# EAGLE board BBQ (EAGLE 6.5.0)
CHECK_DATE: 11.03.14; CHECK_NAME: Mart Liik; COMPANY: TRINAMIC; DRAW_DATE: 11.03.14; DRAW_NAME: Ahto Moorast; PROJECT: TMC Breakout board panel 1; REV: 01B
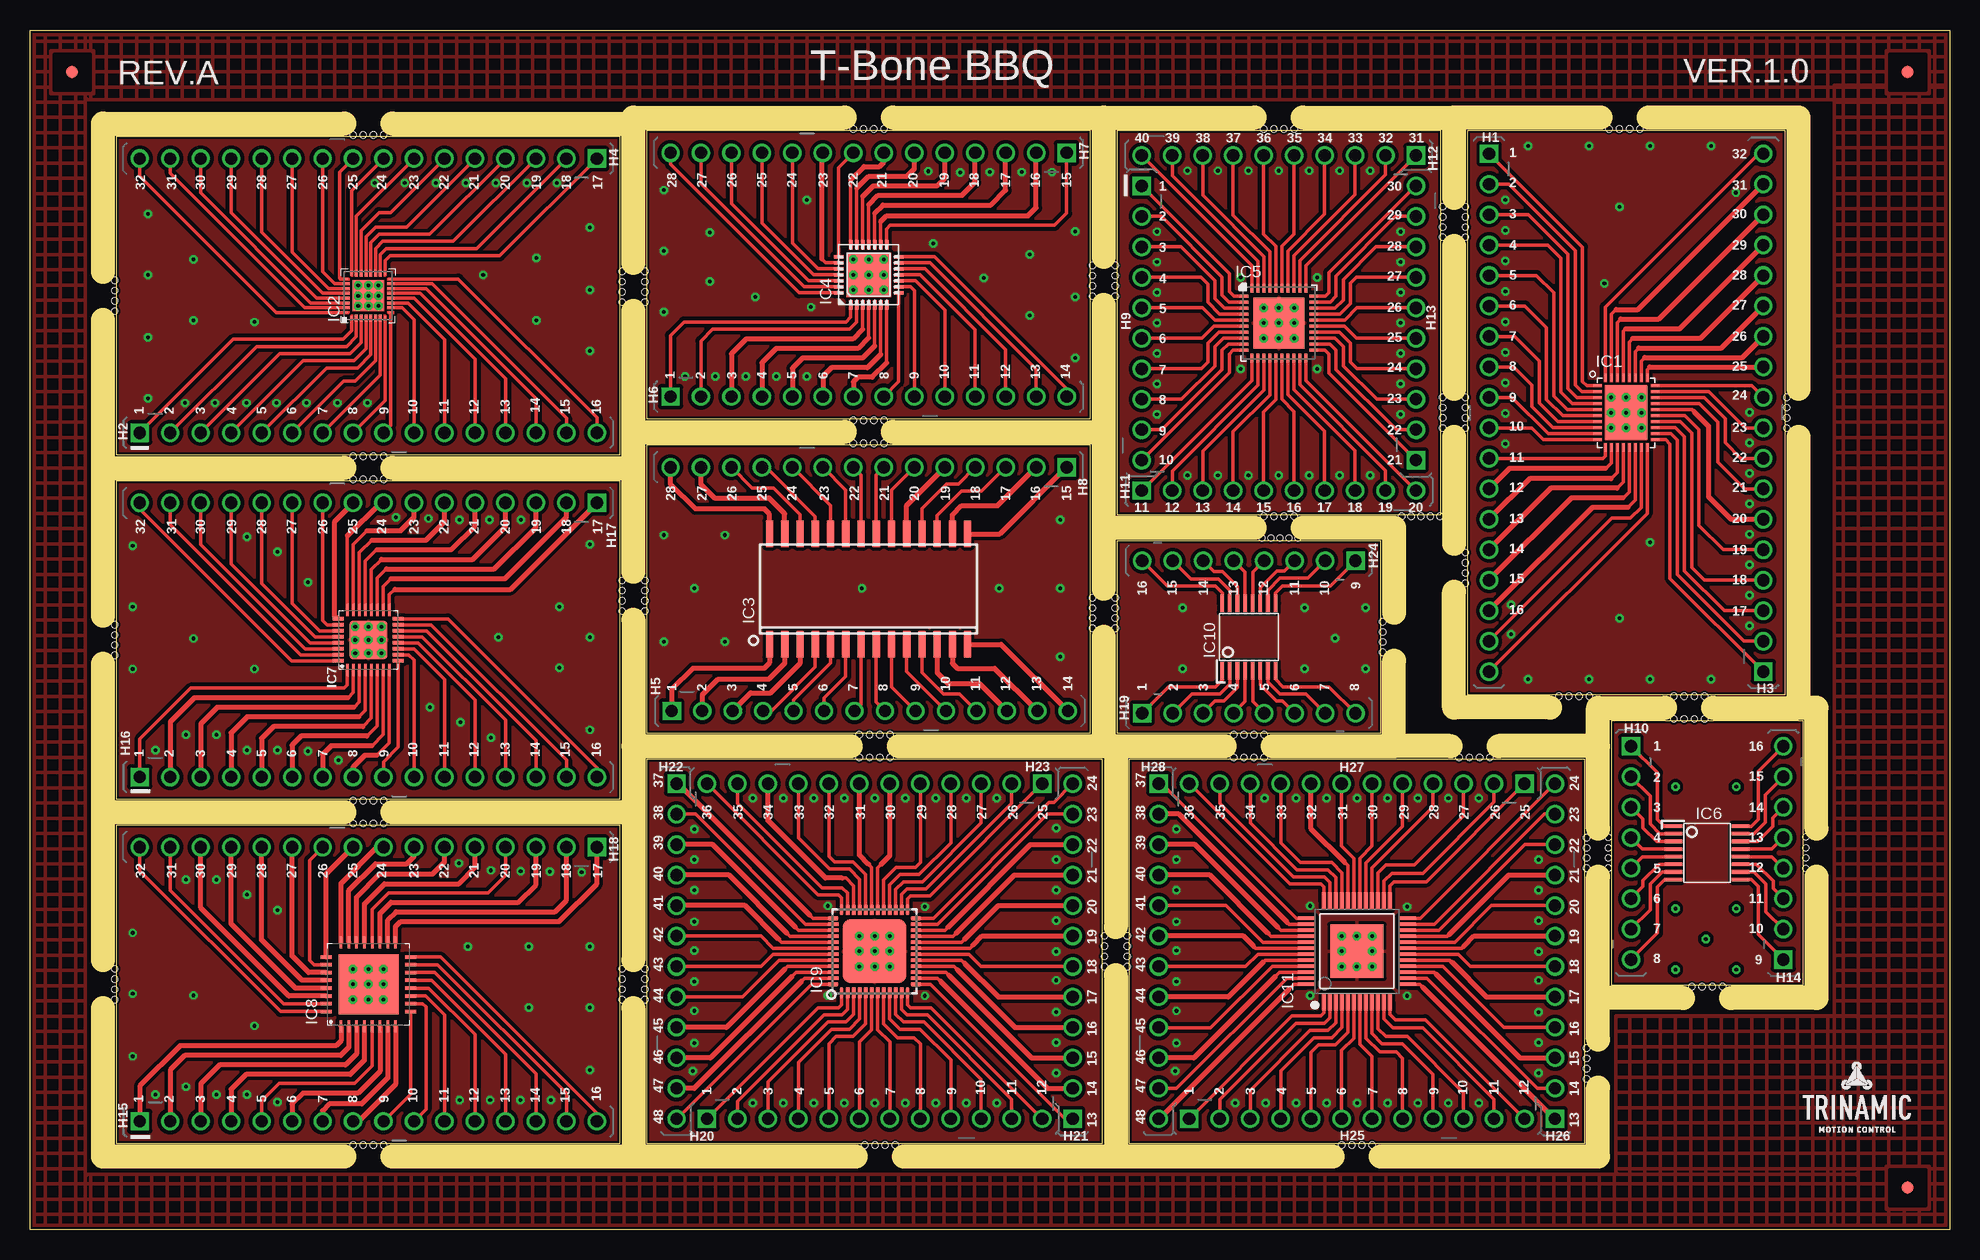
[diagram p3: board, top side]
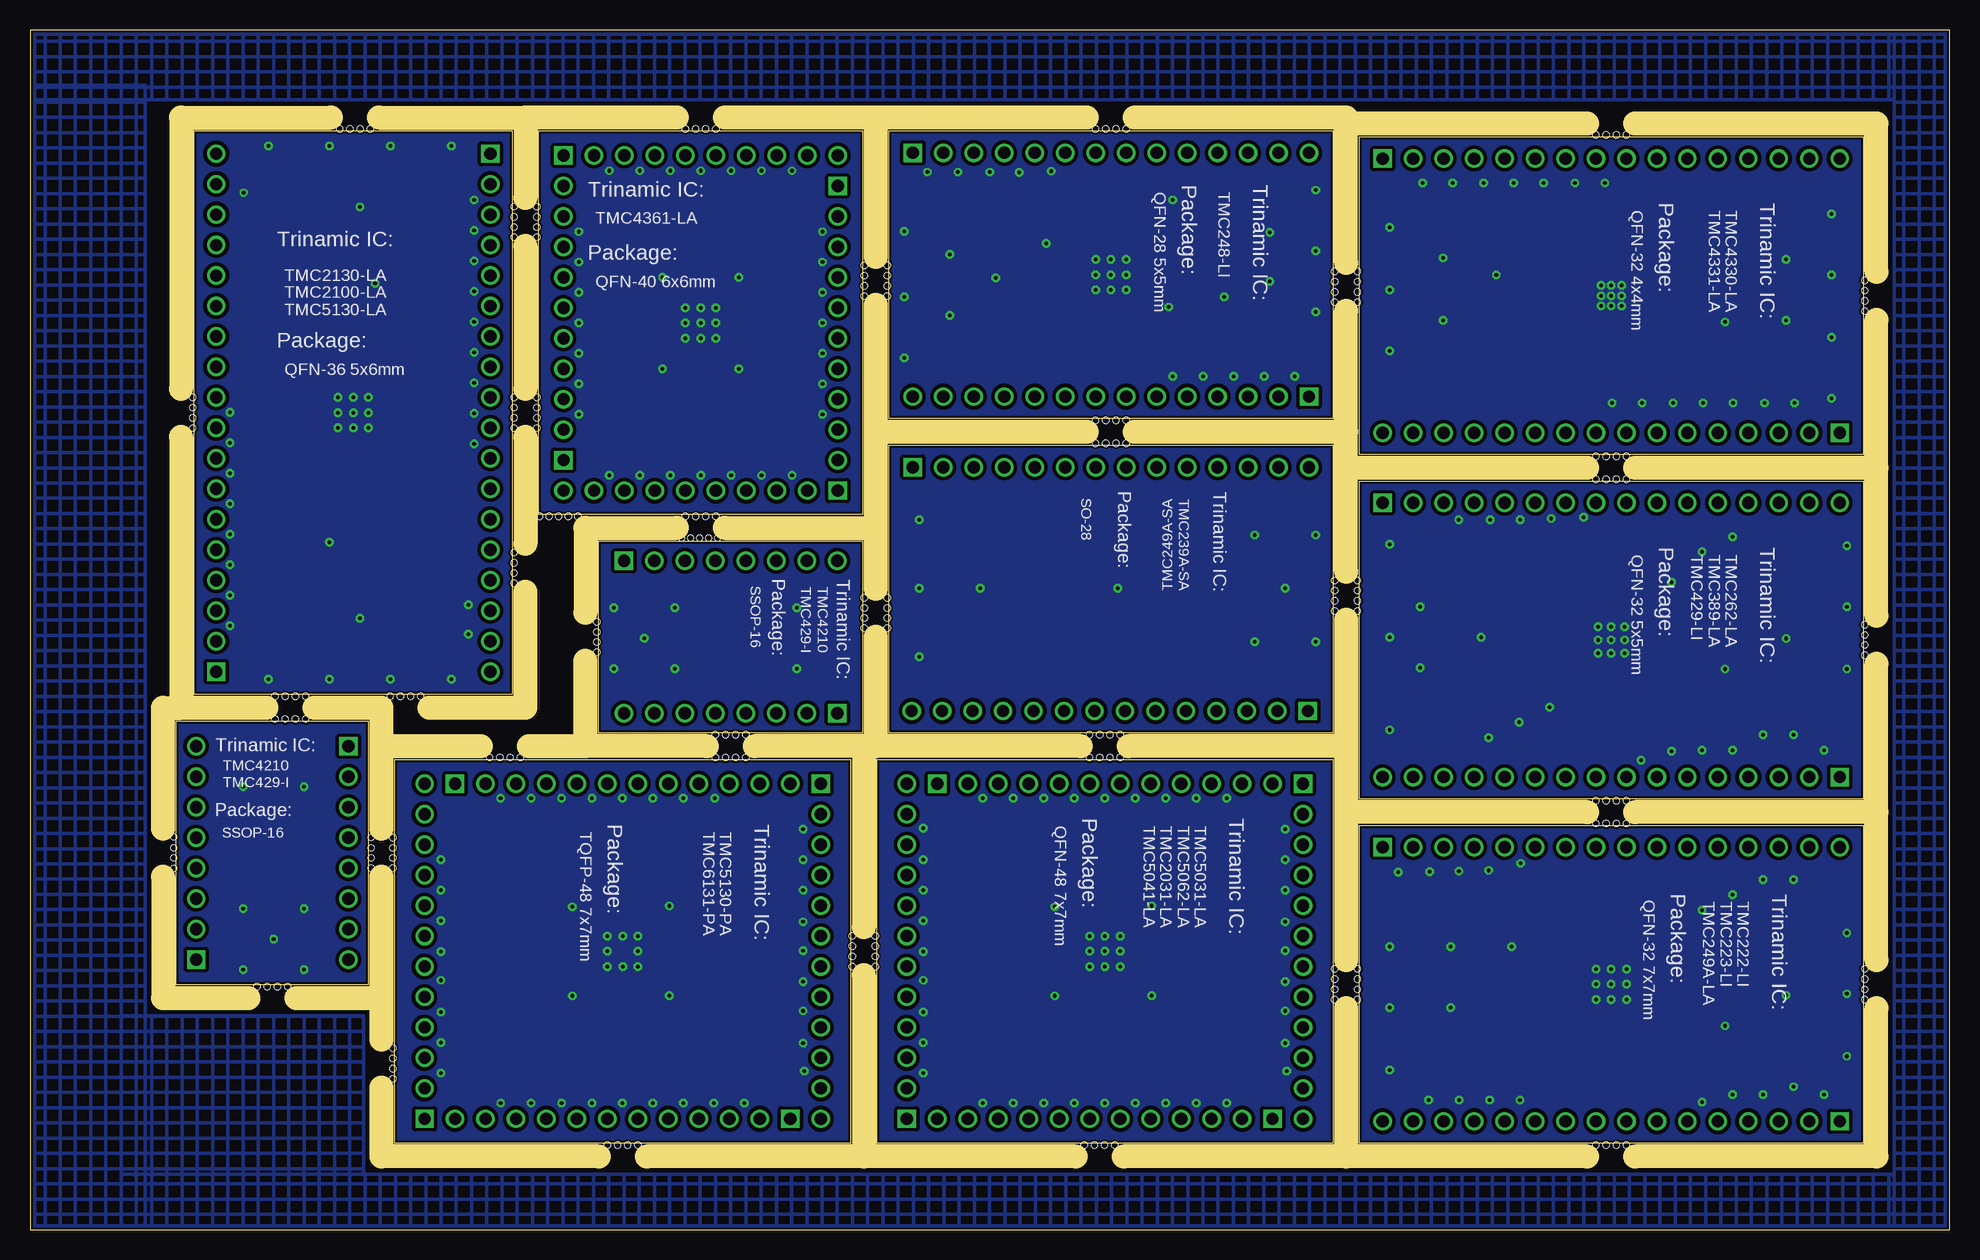
[diagram p4: board, bottom side, seen from below]

Size 160 x 100 mm. Coordinates in mm from the lower left corner, seen from the top.
Outline: 131.8,20.4 147.8,20.4 147.8,42.4 131.8,42.4 131.8,20.4
Outline: 88.4,41.4 88.4,65.4 51.4,65.4 51.4,41.4 88.4,41.4
Outline: 49.2,35.9 49.2,62.4 7.2,62.4 7.2,35.9 49.2,35.9
Outline: 49.2,7.2 49.2,33.7 7.2,33.7 7.2,7.2 49.2,7.2
Outline: 49.2,64.6 49.2,91.1 7.2,91.1 7.2,64.6 49.2,64.6
Outline: 88.4,67.6 88.4,91.6 51.4,91.6 51.4,67.6 88.4,67.6
Outline: 89.4,7.2 89.4,39.2 51.4,39.2 51.4,7.2 89.4,7.2
Outline: 90.6,59.6 117.6,59.6 117.6,91.6 90.6,91.6 90.6,59.6
Outline: 119.8,44.6 146.3,44.6 146.3,91.6 119.8,91.6 119.8,44.6
Outline: 129.6,7.2 129.6,39.2 91.6,39.2 91.6,7.2 129.6,7.2
Outline: 112.6,41.4 112.6,57.4 90.6,57.4 90.6,41.4 112.6,41.4
Outline: 0,0 0,100 160,100 160,0 0,0
Copper layers (1*16): Top 0.035mm / dielectric 1.5mm / Bottom 0.035mm
Design rules "Brandner_Artec *": minimum track width 0.3mm, minimum drill 0.3mm, track to track 0.3mm, track to pad 0.35mm, pad to pad 0.4mm, via to via 0.3mm, smd to smd 0.3mm, copper to edge 0.2mm, drill to drill 0.15mm, minimum pad ring 10mil, minimum via ring 0.2mm, stop-mask expansion 0.1mm, vias tented up to drill 0.3mm, thermal gap 10mil
Net classes: 0 default: width 0.3 mm, drill 0.3 mm, clearance 0.3 mm; 1 wider: width 0.4 mm, drill 0.3 mm, clearance 0.4 mm
Holes 0.5 mm at 26.93,35.75 7.05,79.12 7.05,78.27 7.05,77.42 7.05,76.57 26.93,91.25 27.78,91.25 28.63,91.25 29.48,91.25 51.25,21.72 49.35,21.72 51.25,20.87 51.25,20.02 51.25,19.17 49.35,20.87 49.35,20.02 49.35,19.17 7.05,50.42 7.05,49.57 7.05,48.72 7.05,47.87 7.05,21.72 7.05,20.87 7.05,20.02 7.05,19.17 27.78,35.75 28.63,35.75 29.48,35.75 26.93,33.85 27.78,33.85 28.63,33.85 29.48,33.85 26.93,64.45 27.78,64.45 28.63,64.45 29.48,64.45 26.93,62.55 27.78,62.55 28.63,62.55 29.48,62.55 26.93,7.05 27.78,7.05 28.63,7.05 29.48,7.05 69.58,7.05 70.43,7.05 71.28,7.05 72.13,7.05 109.33,7.05 110.18,7.05 111.03,7.05 111.88,7.05 68.63,91.75 69.48,91.75 70.33,91.75 71.18,91.75 102.83,91.75 103.68,91.75 104.53,91.75 105.38,91.75 131.63,91.75 132.48,91.75 133.33,91.75 134.18,91.75 49.35,79.87 49.35,79.02 49.35,78.17 49.35,77.32 51.25,79.87 51.25,79.02 51.25,78.17 51.25,77.32 49.35,54.11 49.35,53.26 49.35,52.41 49.35,51.56 51.25,54.11 51.25,53.26 51.25,52.41 51.25,51.56 68.63,67.45 69.48,67.45 70.33,67.45 71.18,67.45 68.63,65.55 69.48,65.55 70.33,65.55 71.18,65.55 69.13,41.25 69.98,41.25 70.83,41.25 71.68,41.25 69.13,39.35 69.98,39.35 70.83,39.35 71.68,39.35 88.55,80.37 88.55,79.52 88.55,78.67 88.55,77.82 90.45,80.37 90.45,79.52 90.45,78.67 90.45,77.82 88.55,52.67 88.55,51.82 88.55,50.97 88.55,50.12 90.45,52.67 90.45,51.82 90.45,50.97 90.45,50.12 89.55,24.47 89.55,23.62 89.55,22.77 89.55,21.92 91.45,24.47 91.45,23.62 91.45,22.77 91.45,21.92 100.33,41.25 101.18,41.25 102.03,41.25 102.88,41.25 100.33,39.35 101.18,39.35 102.03,39.35 102.88,39.35 112.75,50.67 112.75,49.82 112.75,48.97 112.75,48.12 119.13,39.35 119.98,39.35 120.83,39.35 121.68,39.35 119.65,85.27 119.65,84.42 119.65,83.57 119.65,82.72 119.65,69.37 119.65,68.52 119.65,67.67 119.65,66.82 119.65,56.43 119.65,55.58 119.65,54.73 119.65,53.88 127.43,44.46 128.28,44.46 129.13,44.46 129.98,44.46 137.03,44.46 137.88,44.46 138.73,44.46 139.58,44.46 129.75,15.12 129.75,14.27 129.75,13.42 129.75,12.57 138.53,20.25 139.38,20.25 140.23,20.25 141.08,20.25 148.03,32.72 148.03,31.82 148.03,30.97 148.03,30.09 146.45,69.37 146.45,68.52 146.45,67.67 137.03,42.56 137.88,42.56 138.73,42.56 139.58,42.56 102.83,59.45 103.68,59.45 104.53,59.45 105.38,59.45 102.68,57.65 103.43,57.65 104.18,57.65 104.93,57.65 146.45,66.82 114.33,59.45 115.13,59.45 115.93,59.45 116.73,59.45 117.53,59.45 117.75,85.27 117.75,84.42 117.75,83.57 117.75,82.72 117.75,69.37 117.75,68.52 117.75,67.67 117.75,66.82 105.68,57.65 129.75,32.67 129.75,31.82 129.75,30.97 129.75,30.12 131.57,32.7 131.57,31.82 131.57,30.97 131.57,30.12
Milling: 72 lines

## Footprints (pad centres in the part's own frame; a part is rotated, then mirrored left to right if it is on the bottom)
FIDUCIAL = smd 1 x 1: FID 0,0
18PIN_2.54_TH = drill 1.02 square: 1 -21.59,0 | drill 1.02: 2 -19.05,0; 3 -16.51,0; 4 -13.97,0; 5 -11.43,0; 6 -8.89,0; 7 -6.35,0; 8 -3.81,0; 9 -1.27,0; 10 1.27,0; 11 3.81,0; 12 6.35,0; 13 8.89,0; 14 11.43,0; 15 13.97,0; 16 16.51,0; 17 19.05,0; 18 21.59,0
16PIN_2.54_TH = drill 1.02 square: 1 -19.05,0 | drill 1.02: 2 -16.51,0; 3 -13.97,0; 4 -11.43,0; 5 -8.89,0; 6 -6.35,0; 7 -3.81,0; 8 -1.27,0; 9 1.27,0; 10 3.81,0; 11 6.35,0; 12 8.89,0; 13 11.43,0; 14 13.97,0; 15 16.51,0; 16 19.05,0
14PIN_2.54_TH = drill 1.02 square: 1 -16.51,0 | drill 1.02: 2 -13.97,0; 3 -11.43,0; 4 -8.89,0; 5 -6.35,0; 6 -3.81,0; 7 -1.27,0; 8 1.27,0; 9 3.81,0; 10 6.35,0; 11 8.89,0; 12 11.43,0; 13 13.97,0; 14 16.51,0
10PIN_2.54_TH = drill 1.02 square: 1 -11.43,0 | drill 1.02: 2 -8.89,0; 3 -6.35,0; 4 -3.81,0; 5 -1.27,0; 6 1.27,0; 7 3.81,0; 8 6.35,0; 9 8.89,0; 10 11.43,0
8PIN_2.54_TH = drill 1.02 square: 1 -8.89,0 | drill 1.02: 2 -6.35,0; 3 -3.81,0; 4 -1.27,0; 5 1.27,0; 6 3.81,0; 7 6.35,0; 8 8.89,0
12PIN_2.54_TH = drill 1.02 square: 1 -13.97,0 | drill 1.02: 2 -11.43,0; 3 -8.89,0; 4 -6.35,0; 5 -3.81,0; 6 -1.27,0; 7 1.27,0; 8 3.81,0; 9 6.35,0; 10 8.89,0; 11 11.43,0; 12 13.97,0
QFN36 = smd 0.7 x 0.25: 1 -2.4,2.25; 2 -2.4,1.75; 3 -2.4,1.25; 4 -2.4,0.75; 5 -2.4,0.25; 6 -2.4,-0.25; 7 -2.4,-0.75; 8 -2.4,-1.25; 9 -2.4,-1.75; 10 -2.4,-2.25; 19 2.4,-2.25; 20 2.4,-1.75; 21 2.4,-1.25; 22 2.4,-0.75; 23 2.4,-0.25; 24 2.4,0.25; 25 2.4,0.75; 26 2.4,1.25; 27 2.4,1.75; 28 2.4,2.25 | smd 0.25 x 0.7: 11 -1.75,-2.9; 12 -1.25,-2.9; 13 -0.75,-2.9; 14 -0.25,-2.9; 15 0.25,-2.9; 16 0.75,-2.9; 17 1.25,-2.9; 18 1.75,-2.9; 29 1.75,2.9; 30 1.25,2.9; 31 0.75,2.9; 32 0.25,2.9; 33 -0.25,2.9; 34 -0.75,2.9; 35 -1.25,2.9; 36 -1.75,2.9 | smd 3.6 x 4.6: GND_PAD 0,0
QFN-32_4X4 = smd 2.6 x 2.6: EXP 0,0 | smd 0.29 x 0.125: P1 -1.86,1.4; P8 -1.86,-1.4; P17 1.86,-1.4; P24 1.86,1.4 | smd 0.58 x 0.25: P2 -1.86,1; P3 -1.86,0.6; P4 -1.86,0.2; P5 -1.86,-0.2; P6 -1.86,-0.6; P7 -1.86,-1; P18 1.86,-1; P19 1.86,-0.6; P20 1.86,-0.2; P21 1.86,0.2; P22 1.86,0.6; P23 1.86,1 | smd 0.125 x 0.29: P9 -1.4,-1.86; P16 1.4,-1.86; P25 1.4,1.86; P32 -1.4,1.86 | smd 0.25 x 0.58: P10 -1,-1.86; P11 -0.6,-1.86; P12 -0.2,-1.86; P13 0.2,-1.86; P14 0.6,-1.86; P15 1,-1.86; P26 1,1.86; P27 0.6,1.86; P28 0.2,1.86; P29 -0.2,1.86; P30 -0.6,1.86; P31 -1,1.86
SO28 = smd 2.2 x 0.6: 1 -4.6,8.255; 2 -4.6,6.985; 3 -4.6,5.715; 4 -4.6,4.445; 5 -4.6,3.175; 6 -4.6,1.905; 7 -4.6,0.635; 8 -4.6,-0.635; 9 -4.6,-1.905; 10 -4.6,-3.175; 11 -4.6,-4.445; 12 -4.6,-5.715; 13 -4.6,-6.985; 14 -4.6,-8.255; 15 4.6,-8.255; 16 4.6,-6.985; 17 4.6,-5.715; 18 4.6,-4.445; 19 4.6,-3.175; 20 4.6,-1.905; 21 4.6,-0.635; 22 4.6,0.635; 23 4.6,1.905; 24 4.6,3.175; 25 4.6,4.445; 26 4.6,5.715; 27 4.6,6.985; 28 4.6,8.255
QFN28_5X5 = smd 0.8 x 0.3: 1 -2.5,1.5; 2 -2.5,1; 3 -2.5,0.5; 4 -2.5,0; 5 -2.5,-0.5; 6 -2.5,-1; 7 -2.5,-1.5; 15 2.5,-1.5; 16 2.5,-1; 17 2.5,-0.5; 18 2.5,0; 19 2.5,0.5; 20 2.5,1; 21 2.5,1.5 | smd 0.3 x 0.8: 8 -1.5,-2.5; 9 -1,-2.5; 10 -0.5,-2.5; 11 0,-2.5; 12 0.5,-2.5; 13 1,-2.5; 14 1.5,-2.5; 22 1.5,2.5; 23 1,2.5; 24 0.5,2.5; 25 0,2.5; 26 -0.5,2.5; 27 -1,2.5; 28 -1.5,2.5 | smd 3.7 x 3.7: PAD 0,0
QFN40L = smd 0.7 x 0.25: 1 -2.9,2.25; 2 -2.9,1.75; 3 -2.9,1.25; 4 -2.9,0.75; 5 -2.9,0.25; 6 -2.9,-0.25; 7 -2.9,-0.75; 8 -2.9,-1.25; 9 -2.9,-1.75; 10 -2.9,-2.25; 21 2.9,-2.25; 22 2.9,-1.75; 23 2.9,-1.25; 24 2.9,-0.75; 25 2.9,-0.25; 26 2.9,0.25; 27 2.9,0.75; 28 2.9,1.25; 29 2.9,1.75; 30 2.9,2.25 | smd 0.25 x 0.7: 11 -2.25,-2.9; 12 -1.75,-2.9; 13 -1.25,-2.9; 14 -0.75,-2.9; 15 -0.25,-2.9; 16 0.25,-2.9; 17 0.75,-2.9; 18 1.25,-2.9; 19 1.75,-2.9; 20 2.25,-2.9; 31 2.25,2.9; 32 1.75,2.9; 33 1.25,2.9; 34 0.75,2.9; 35 0.25,2.9; 36 -0.25,2.9; 37 -0.75,2.9; 38 -1.25,2.9; 39 -1.75,2.9; 40 -2.25,2.9 | smd 4.26 x 4.26: EXP 0,0
SSOP16 = smd 1.46 x 0.3: 1 -2.8,2.223; 2 -2.8,1.587; 3 -2.8,0.953; 4 -2.8,0.318; 5 -2.8,-0.318; 6 -2.8,-0.953; 7 -2.8,-1.587; 8 -2.8,-2.223; 9 2.8,-2.223; 10 2.8,-1.587; 11 2.8,-0.953; 12 2.8,-0.318; 13 2.8,0.318; 14 2.8,0.953; 15 2.8,1.587; 16 2.8,2.223
QFN32_5X5 = smd 1 x 0.3: 1 -2.5,1.75; 2 -2.5,1.25; 3 -2.5,0.75; 4 -2.5,0.25; 5 -2.5,-0.25; 6 -2.5,-0.75; 7 -2.5,-1.25; 8 -2.5,-1.75; 17 2.5,-1.75; 18 2.5,-1.25; 19 2.5,-0.75; 20 2.5,-0.25; 21 2.5,0.25; 22 2.5,0.75; 23 2.5,1.25; 24 2.5,1.75 | smd 0.3 x 1: 9 -1.75,-2.5; 10 -1.25,-2.5; 11 -0.75,-2.5; 12 -0.25,-2.5; 13 0.25,-2.5; 14 0.75,-2.5; 15 1.25,-2.5; 16 1.75,-2.5; 25 1.75,2.5; 26 1.25,2.5; 27 0.75,2.5; 28 0.25,2.5; 29 -0.25,2.5; 30 -0.75,2.5; 31 -1.25,2.5; 32 -1.75,2.5 | smd 3.2 x 3.2: EXP 0,0
QFN32_7X7 = smd 1 x 0.3: 1 -3.505,2.28; 2 -3.505,1.63; 3 -3.505,0.98; 4 -3.505,0.33; 5 -3.505,-0.32; 6 -3.505,-0.97; 7 -3.505,-1.62; 8 -3.505,-2.27; 17 3.5,-2.275; 18 3.5,-1.625; 19 3.5,-0.975; 20 3.5,-0.325; 21 3.5,0.325; 22 3.5,0.975; 23 3.5,1.625; 24 3.5,2.275 | smd 0.3 x 1: 9 -2.275,-3.525; 10 -1.625,-3.525; 11 -0.975,-3.525; 12 -0.325,-3.525; 13 0.325,-3.525; 14 0.975,-3.525; 15 1.625,-3.525; 16 2.275,-3.525; 25 2.275,3.5; 26 1.625,3.5; 27 0.975,3.5; 28 0.325,3.5; 29 -0.325,3.5; 30 -0.975,3.5; 31 -1.625,3.5; 32 -2.275,3.5 | smd 5 x 5: EXP -0.01,-0.02
QFN-48_7X7 = smd 0.85 x 0.3: P$1 -3.45,2.75; P$2 -3.45,2.25; P$3 -3.45,1.75; P$4 -3.45,1.25; P$5 -3.45,0.75; P$6 -3.45,0.25; P$7 -3.45,-0.25; P$8 -3.45,-0.75; P$9 -3.45,-1.25; P$10 -3.45,-1.75; P$11 -3.45,-2.25; P$12 -3.45,-2.75; P$25 3.45,-2.75; P$26 3.45,-2.25; P$27 3.45,-1.75; P$28 3.45,-1.25; P$29 3.45,-0.75; P$30 3.45,-0.25; P$31 3.45,0.25; P$32 3.45,0.75; P$33 3.45,1.25; P$34 3.45,1.75; P$35 3.45,2.25; P$36 3.45,2.75 | smd 0.3 x 0.85: P$13 -2.75,-3.45; P$14 -2.25,-3.45; P$15 -1.75,-3.45; P$16 -1.25,-3.45; P$17 -0.75,-3.45; P$18 -0.25,-3.45; P$19 0.25,-3.45; P$20 0.75,-3.45; P$21 1.25,-3.45; P$22 1.75,-3.45; P$23 2.25,-3.45; P$24 2.75,-3.45; P$37 2.75,3.45; P$38 2.25,3.45; P$39 1.75,3.45; P$40 1.25,3.45; P$41 0.75,3.45; P$42 0.25,3.45; P$43 -0.25,3.45; P$44 -0.75,3.45; P$45 -1.25,3.45; P$46 -1.75,3.45; P$47 -2.25,3.45; P$48 -2.75,3.45 | smd 5.3 x 5.3: P$49 0,0
TQFP48-EP = smd 1.45 x 0.3: 1 -4.2,2.75; 2 -4.2,2.25; 3 -4.2,1.75; 4 -4.2,1.25; 5 -4.2,0.75; 6 -4.2,0.25; 7 -4.2,-0.25; 8 -4.2,-0.75; 9 -4.2,-1.25; 10 -4.2,-1.75; 11 -4.2,-2.25; 12 -4.2,-2.75; 25 4.2,-2.75; 26 4.2,-2.25; 27 4.2,-1.75; 28 4.2,-1.25; 29 4.2,-0.75; 30 4.2,-0.25; 31 4.2,0.25; 32 4.2,0.75; 33 4.2,1.25; 34 4.2,1.75; 35 4.2,2.25; 36 4.2,2.75 | smd 0.3 x 1.45: 13 -2.75,-4.2; 14 -2.25,-4.2; 15 -1.75,-4.2; 16 -1.25,-4.2; 17 -0.75,-4.2; 18 -0.25,-4.2; 19 0.25,-4.2; 20 0.75,-4.2; 21 1.25,-4.2; 22 1.75,-4.2; 23 2.25,-4.2; 24 2.75,-4.2; 37 2.75,4.2; 38 2.25,4.2; 39 1.75,4.2; 40 1.25,4.2; 41 0.75,4.2; 42 0.25,4.2; 43 -0.25,4.2; 44 -0.75,4.2; 45 -1.25,4.2; 46 -1.75,4.2; 47 -2.25,4.2; 48 -2.75,4.2 | smd 4.45 x 4.45: PAD 0,0

## Placement (x,y rotation side)
FID1  FIDUCIAL  [FIDUCIAL]  3.5,96.5 0 top
FID3  FIDUCIAL  [FIDUCIAL]  156.5,3.5 0 top
FID4  FIDUCIAL  [FIDUCIAL]  156.5,96.5 0 top
H1  HEADER_18PIN1X  [18PIN_2.54_TH]  121.62,68.1 270 top
H2  HEADER_16PIN1X  [16PIN_2.54_TH]  28.2,66.42 0 top
H3  HEADER_18PIN1X  [18PIN_2.54_TH]  144.48,68.1 90 top
H4  HEADER_16PIN1X  [16PIN_2.54_TH]  28.2,89.28 180 top
H5  HEADER_14PIN1X  [14PIN_2.54_TH]  70,43.23 0 top
H6  HEADER_14PIN1X  [14PIN_2.54_TH]  69.9,69.44 0 top
H7  HEADER_14PIN1X  [14PIN_2.54_TH]  69.9,89.76 180 top
H8  HEADER_14PIN1X  [14PIN_2.54_TH]  69.9,63.55 180 top
H9  HEADER_10PIN1X  [10PIN_2.54_TH]  92.67,75.57 270 top
H10  HEADER_8PIN1X  [8PIN_2.54_TH]  133.45,31.4 270 top
H11  HEADER_10PIN1X  [10PIN_2.54_TH]  104.1,61.6 0 top
H12  HEADER_10PIN1X  [10PIN_2.54_TH]  104.1,89.54 180 top
H13  HEADER_10PIN1X  [10PIN_2.54_TH]  115.53,75.57 90 top
H14  HEADER_8PIN1X  [8PIN_2.54_TH]  146.15,31.4 90 top
H15  HEADER_16PIN1X  [16PIN_2.54_TH]  28.2,9.02 0 top
H16  HEADER_16PIN1X  [16PIN_2.54_TH]  28.2,37.72 0 top
H17  HEADER_16PIN1X  [16PIN_2.54_TH]  28.2,60.58 180 top
H18  HEADER_16PIN1X  [16PIN_2.54_TH]  28.2,31.88 180 top
H19  HEADER_8PIN1X  [8PIN_2.54_TH]  101.6,43.05 0 top
H20  HEADER_12PIN1X  [12PIN_2.54_TH]  70.4,9.23 0 top
H21  HEADER_12PIN1X  [12PIN_2.54_TH]  86.91,23.2 90 top
H22  HEADER_12PIN1X  [12PIN_2.54_TH]  53.89,23.2 270 top
H23  HEADER_12PIN1X  [12PIN_2.54_TH]  70.4,37.17 180 top
H24  HEADER_8PIN1X  [8PIN_2.54_TH]  101.6,55.75 180 top
H25  HEADER_12PIN1X  [12PIN_2.54_TH]  110.6,9.23 0 top
H26  HEADER_12PIN1X  [12PIN_2.54_TH]  127.11,23.2 90 top
H27  HEADER_12PIN1X  [12PIN_2.54_TH]  110.6,37.17 180 top
H28  HEADER_12PIN1X  [12PIN_2.54_TH]  94.09,23.2 270 top
IC1  TMC2130_QFN36  [QFN36]  133.05,68.1 0 top
IC2  TMC4330-LA  [QFN-32_4X4]  28.2,77.85 90 top
IC3  TMC249A-SA  [SO28]  69.9,53.4 90 top
IC4  TMC248  [QFN28_5X5]  69.9,79.6 90 top
IC5  TMC4361  [QFN40L]  104.1,75.57 0 top
IC6  TMC429-I  [SSOP16]  139.8,31.4 0 top
IC7  TMC262-LA  [QFN32_5X5]  28.2,49.15 90 top
IC8  TMC222-LI  [QFN32_7X7]  28.2,20.45 90 top
IC9  TMC5031-LA  [QFN-48_7X7]  70.4,23.2 90 top
IC10  TMC429-I  [SSOP16]  101.6,49.4 90 top
IC11  TMC_RHINO  [TQFP48-EP]  110.6,23.2 90 top
U$1  [TRINAMIC_LOGO]  147.77,8.09 0 top
U$3  [T-BONE_LOGO]  139.36,11.81 0 top
U$4  [T-BONE_LOGO]  139.84,25.33 0 top
U$5  [T-BONE_LOGO]  119.64,23.12 90 top
U$6  [T-BONE_LOGO]  79.19,23.2 90 top
U$7  [T-BONE_LOGO]  39.18,20.35 90 top
U$8  [T-BONE_LOGO]  39.32,49.19 90 top
U$9  [T-BONE_LOGO]  39.01,77.89 90 top
U$10  [T-BONE_LOGO]  79.76,79.53 90 top
U$11  [T-BONE_LOGO]  104.23,68.42 0 top
U$13  [T-BONE_LOGO]  133.06,56.05 0 top
U$15  [T-BONE_LOGO]  107.44,49.43 90 top
U$16  [T-BONE_LOGO]  83.19,53.48 90 top

## Tracks (layer width: path | path; a pad name or v marks a point on that pad's centre or on a via)
092_1
  Top 0.3: IC7.1 26.45,45.38 26.2,45.13 13.4,45.13 9.15,40.88 H16.1
092_2
  Top 0.3: IC7.2 26.95,44.78 26.5,44.33
  Top 0.4: 26.5,44.33 13.7,44.33 11.69,42.32 H16.2
092_3
  Top 0.3: IC7.3 27.45,43.98 27,43.53
  Top 0.4: 27,43.53 15.6,43.53 14.23,42.16 H16.3
092_4
  Top 0.3: IC7.4 27.95,43.28 27.4,42.73
  Top 0.4: 27.4,42.73 18.1,42.73 16.77,41.4 H16.4
092_5
  Top 0.3: IC7.5 28.45,42.63 27.75,41.93
  Top 0.4: 27.75,41.93 20.3,41.93 19.31,40.94 H16.5
092_6
  Top 0.3: IC7.6 28.95,41.98 28.1,41.13
  Top 0.4: 28.1,41.13 22.6,41.13 21.85,40.38 H16.6
092_7
  Top 0.3: IC7.7 29.45,41.28 28.5,40.33
  Top 0.4: 28.5,40.33 25.1,40.33 24.39,39.62 H16.7
092_8
  Top 0.3: IC7.8 29.95,40.58 28.9,39.53
  Top 0.4: 28.9,39.53 27.9,39.53 26.93,38.56 H16.8
092_9
  Top 0.3: IC7.9 30.7,40.23 29.47,39 H16.9
092_10
  Top 0.3: IC7.10 31.57,47.9 32.01,47.46 H16.10
092_11
  Top 0.3: IC7.11 32,48.4 34.55,45.85 H16.11
092_12
  Top 0.3: IC7.12 32.35,48.9 37.09,44.16 H16.12
092_13
  Top 0.3: IC7.13 32.7,49.4 39.63,42.47 H16.13
092_14
  Top 0.3: IC7.14 33.05,49.9 42.17,40.78 H16.14
092_15
  Top 0.3: IC7.15 33.45,50.4 44.71,39.14 H16.15
092_16
  Top 0.3: IC7.16 34.85,50.9 47.25,38.5 H16.16
092_17
  Top 0.3: IC7.17 29.95,52.92 30.4,53.37
  Top 0.4: 30.4,53.37 40.05,53.37 H17.1
092_18
  Top 0.3: IC7.18 29.45,53.62 30.1,54.27
  Top 0.4: 30.1,54.27 39.6,54.27 44.71,59.38 H17.2
092_19
  Top 0.3: IC7.19 28.95,54.32 29.7,55.07
  Top 0.4: 29.7,55.07 38.7,55.07 42.17,58.54 H17.3
092_20
  Top 0.3: IC7.20 28.45,55.02 29.3,55.87
  Top 0.4: 29.3,55.87 36.9,55.87 39.63,58.6 H17.4
092_21
  Top 0.3: IC7.21 27.95,55.72 28.9,56.67
  Top 0.4: 28.9,56.67 35.1,56.67 37.09,58.66 H17.5
092_22
  Top 0.3: IC7.22 27.45,56.42 28.5,57.47
  Top 0.4: 28.5,57.47 33,57.47 34.55,59.02 H17.6
092_23
  Top 0.3: IC7.23 26.95,57.12 28.1,58.27
  Top 0.4: 28.1,58.27 30.9,58.27 32.01,59.38 H17.7
092_24
  Top 0.3: IC7.24 26.45,57.82
  Top 0.4: 26.45,57.82 29.21,60.58 H17.8
092_25
  Top 0.3: IC7.25 25.7,51.05 25.4,51.05
  Top 0.4: 25.4,51.05 25.4,59.04 H17.9
092_26
  Top 0.3: IC7.26 24.75,50.4 24.39,50.76 H17.10
092_27
  Top 0.3: IC7.27 24.15,49.9 21.85,52.2 H17.11
092_28
  Top 0.3: IC7.28 23.75,49.4 19.31,53.84 H17.12
092_29
  Top 0.3: IC7.29 23.35,48.9 16.77,55.48 H17.13
092_30
  Top 0.3: IC7.30 22.95,48.4 14.23,57.12 H17.14
092_31
  Top 0.3: IC7.31 22.55,47.9 11.69,58.76 H17.15
092_32
  Top 0.3: IC7.32 21.8,47.4 9.15,60.05 H17.16
092_GND  (via drill 0.3)
  other vias: 8.56,46.73 8.56,51.93 8.56,57.01 13.64,49.27 18.72,46.73 39.04,49.39 44.12,46.85 44.12,51.93 46.66,41.65 46.66,57.13 46.66,49.39 28.2,49.15 28.2,50.25 29.3,50.25 29.3,49.15 29.3,48.05 28.2,48.05 27.1,48.05 27.1,49.15 27.1,50.25 33.33,43.55 35.87,42.28 38.41,41.02 23.16,53.95 20.62,56.49 18.09,57.77 10.46,39.98 13.01,41.24 15.54,41.24 18.09,39.98 20.62,39.98 23.16,39.88 25.7,39.14 40.9,59.17 38.3,59.17 35.8,59.17 33.2,59.27 30.5,59.37
  pour Bottom (isolate 0.1): 7.2,35.9 49.2,35.9 49.2,62.4 7.2,62.4
  pour Top (isolate 0.1): 7.2,35.9 7.2,62.4 49.2,62.4 49.2,35.9
093_1
  Top 0.4: IC8.1 25.92,15.74 25.5,15.32 12.5,15.32 9.15,11.97 H15.1
093_2
  Top 0.4: IC8.2 26.57,15.19 25.9,14.52 12.9,14.52 11.69,13.31 H15.2
093_3
  Top 0.4: IC8.3 27.22,14.64 26.3,13.72 15.8,13.72 14.23,12.15 H15.3
093_4
  Top 0.4: IC8.4 27.87,14.09 26.7,12.92 18,12.92 16.77,11.69 H15.4
093_5
  Top 0.3: IC8.5 28.52,13.64 27.05,12.17 20.75,12.17 19.31,10.73 H15.5
093_6
  Top 0.4: IC8.6 29.17,13.19 27.35,11.37 22.75,11.37 21.85,10.47 H15.6
093_7
  Top 0.4: IC8.7 29.82,12.64 27.65,10.47 24.95,10.47 24.39,9.91 H15.7
093_8
  Top 0.4: IC8.8 30.47,12.09 27.4,9.02 H15.8
093_9
  Top 0.3: IC8.9 31.73,11.28 H15.9
093_10
  Top 0.3: IC8.10 32.73,18.82 33,18.55 33,10.01 H15.10
093_11
  Top 0.3: IC8.11 32.98,19.48 34.55,17.9 H15.11
093_12
  Top 0.3: IC8.12 33.23,20.12 37.09,16.26 H15.12
093_13
  Top 0.3: IC8.13 33.48,20.77 39.63,14.62 H15.13
093_14
  Top 0.3: IC8.14 33.73,21.43 42.17,12.98 H15.14
093_15
  Top 0.3: IC8.15 33.98,22.07 44.71,11.34 H15.15
093_16
  Top 0.3: IC8.16 34.23,22.73 47.25,9.7 H15.16
093_17
  Top 0.4: IC8.17 30.48,25.25 30.9,25.68 44.1,25.68 47.25,28.83 H18.1
093_18
  Top 0.4: IC8.18 29.82,25.8 30.5,26.48 43.75,26.48 44.71,27.44 H18.2
093_19
  Top 0.4: IC8.19 29.18,26.36 30.1,27.28 40.7,27.28 42.17,28.75 H18.3
093_20
  Top 0.3: IC8.20 28.52,26.7 29.9,28.08 38.2,28.08 39.63,29.51 H18.4
093_21
  Top 0.4: IC8.21 27.88,27.16 29.55,28.83 35.75,28.83 37.09,30.17 H18.5
093_22
  Top 0.4: IC8.22 27.23,27.7 29.15,29.63 33.55,29.63 34.55,30.63 H18.6
093_23
  Top 0.4: IC8.23 26.57,28.25 28.8,30.48 31.4,30.48 32.01,31.09 H18.7
093_24
  Top 0.4: IC8.24 25.93,28.86 28.95,31.88 H18.8
093_25
  Top 0.4: IC8.25 24.7,29.65 H18.9
093_26
  Top 0.3: IC8.26 23.68,22.07 23.3,22.45 23.3,30.79 H18.10
093_27
  Top 0.4: IC8.27 23.23,21.43 21.85,22.8 H18.11
093_28
  Top 0.4: IC8.28 22.68,20.77 19.31,24.14 H18.12
093_29
  Top 0.4: IC8.29 22.12,20.12 16.77,25.48 H18.13
093_30
  Top 0.4: IC8.30 21.57,19.48 14.23,26.82 H18.14
093_31
  Top 0.3: IC8.31 21.12,18.82 11.69,28.26 H18.15
093_32
  Top 0.3: IC8.32 20.88,18.18 9.15,29.9 H18.16
093_GND  (via drill 0.3)
  other vias: 8.56,14.44 8.56,19.65 8.56,24.73 13.64,19.52 18.72,16.98 36.5,23.59 41.58,23.59 46.66,23.59 46.66,18.51 46.66,13.3 41.58,18.51 13.01,29.18 15.54,29.18 18.09,27.91 20.62,26.64 43.34,29.82 45.98,29.8 38.41,29.94 35.77,30.52 10.46,11.27 13.01,11.9 15.54,11.27 18.09,11.27 20.62,10.63 28.2,20.45 28.2,21.72 26.93,21.72 26.93,20.45 26.93,19.18 28.2,19.18 29.47,19.18 29.47,20.45 29.47,21.72 40.9,29.87 35.81,10.79 38.35,10.79 40.89,10.79 43.43,10.79
  pour Bottom (isolate 0.1): 7.2,7.2 49.2,7.2 49.2,33.7 7.2,33.7
  pour Top (isolate 0.1): 7.2,7.2 7.2,33.7 49.2,33.7 49.2,7.2
094_1
  Top 0.3: IC2.P1 26.8,74.92 26.1,74.22 16.95,74.22 H2.1
094_2
  Top 0.3: IC2.P2 27.2,74.42 26.4,73.62 18.89,73.62 H2.2
094_3
  Top 0.3: IC2.P3 27.6,73.92 26.7,73.02 20.83,73.02 H2.3
094_4
  Top 0.3: IC2.P4 28,73.42 27,72.42 22.77,72.42 H2.4
094_5
  Top 0.3: IC2.P5 28.4,72.92 27.3,71.82 24.71,71.82 H2.5
094_6
  Top 0.3: IC2.P6 28.8,72.42 27.1,70.72 26.15,70.72 H2.6
094_7
  Top 0.3: IC2.P7 29.2,71.23 H2.7
094_8
  Top 0.3: IC2.P8 29.6,69.09 H2.8
094_9
  Top 0.3: IC2.P9 30.06,67.01 H2.9
094_10
  Top 0.3: IC2.P10 31,76.85 32.01,75.84 H2.10
094_11
  Top 0.3: IC2.P11 31.5,77.25 34.55,74.2 H2.11
094_12
  Top 0.3: IC2.P12 32,77.65 37.09,72.56 H2.12
094_13
  Top 0.3: IC2.P13 32.5,78.05 39.63,70.92 H2.13
094_14
  Top 0.3: IC2.P14 33,78.45 42.17,69.28 H2.14
094_15
  Top 0.3: IC2.P15 33.5,78.85 44.71,67.64 H2.15
094_16
  Top 0.3: IC2.P16 35.7,79.25 47.25,67.7 H2.16
094_17
  Top 0.3: IC2.P17 29.6,80.78 30,81.18 39.15,81.18 H4.1
094_18
  Top 0.3: IC2.P18 29.2,81.28 29.7,81.78 37.21,81.78 H4.2
094_19
  Top 0.3: IC2.P19 28.8,81.78 29.4,82.38 35.27,82.38 H4.3
094_20
  Top 0.3: IC2.P20 28.4,82.28 29.1,82.98 33.33,82.98 H4.4
094_21
  Top 0.3: IC2.P21 28,82.78 28.8,83.58 31.39,83.58 H4.5
094_22
  Top 0.3: IC2.P22 27.6,83.28 29.1,84.78 30.05,84.78 H4.6
094_23
  Top 0.3: IC2.P23 27.2,84.47 H4.7
094_24
  Top 0.3: IC2.P24 26.8,86.61 H4.8
094_25
  Top 0.3: H4.9 25.8,88.15 25.8,79.31 25.86,79.25 IC2.P25
094_26
  Top 0.3: IC2.P26 25.4,78.85 24.39,79.86 H4.10
094_27
  Top 0.3: IC2.P27 24.9,78.45 21.85,81.5 H4.11
094_28
  Top 0.3: IC2.P28 24.4,78.05 19.31,83.14 H4.12
094_29
  Top 0.3: IC2.P29 23.9,77.65 16.77,84.78 H4.13
094_30
  Top 0.3: IC2.P30 23.4,77.25 14.23,86.42 H4.14
094_31
  Top 0.3: IC2.P31 22.9,76.85 11.69,88.06 H4.15
094_32
  Top 0.3: IC2.P32 20.5,76.45 9.15,87.8 H4.16
094_GND  (via drill 0.3)
  other vias: 28.2,77.85 27.35,77.85 27.35,78.7 28.2,78.7 28.2,77 27.35,77 29.05,77.85 29.05,78.7 29.05,77 9.83,69.3 9.83,74.38 9.83,79.59 9.83,84.67 13.64,75.78 13.64,80.86 18.72,75.65 37.77,79.59 42.22,80.99 42.22,75.78 46.66,78.32 46.66,73.24 46.66,83.53 12.93,68.9 15.43,68.9 18.03,68.9 20.53,68.9 23.03,68.9 25.63,68.9 28.13,68.9 28.73,87.26 31.23,87.26 33.83,87.26 36.33,87.26 38.83,87.26 41.43,87.26 43.93,87.26
  pour Bottom (isolate 0.1): 7.16,64.6 49.2,64.6 49.2,91.1 7.16,91.1
  pour Top (isolate 0.1): 7.2,64.6 7.2,91.1 49.2,91.1 49.2,64.6
095_1
  Top 0.3: IC4.1 68.4,76.05 68,75.65 54.5,75.65 53.39,74.54 H6.1
095_2
  Top 0.3: IC4.2 68.9,75.65 68.3,75.05 56.9,75.05 55.93,74.08 H6.2
095_3
  Top 0.3: IC4.3 69.4,75.05
  Top 0.4: 69.4,75.05 68.6,74.25 59.7,74.25 58.47,73.02 H6.3
095_4
  Top 0.3: IC4.4 69.9,74.35
  Top 0.4: 69.9,74.35 69,73.45 62.2,73.45 61.01,72.26 H6.4
095_5
  Top 0.3: IC4.5 70.4,73.65
  Top 0.4: 70.4,73.65 69.4,72.65 64.4,72.65 63.55,71.8 H6.5
095_6
  Top 0.3: IC4.6 70.9,72.95
  Top 0.4: 70.9,72.95 69.8,71.85 66.8,71.85 66.09,71.14 H6.6
095_7
  Top 0.3: IC4.7 71.4,72.25
  Top 0.4: H6.7 68.63,70.68 69,71.05 70.2,71.05 71.4,72.25
095_8
  Top 0.3: IC4.8 72.4,70.67 H6.8
095_9
  Top 0.3: IC4.9 73.4,78.6 73.71,78.29 H6.9
095_10
  Top 0.3: IC4.10 73.8,79.1 76.25,76.65 H6.10
095_11
  Top 0.3: IC4.11 74.2,79.6 78.79,75.01 H6.11
095_12
  Top 0.3: IC4.12 74.6,80.1 81.33,73.37 H6.12
095_13
  Top 0.3: IC4.13 75,80.6 83.87,71.73 H6.13
095_14
  Top 0.3: IC4.14 75.4,81.1 86.41,70.09 H6.14
095_15
  Top 0.3: IC4.15 71.4,83.41 71.7,83.71 85.4,83.71 86.41,84.72 H7.1
095_16
  Top 0.3: IC4.16 70.9,84.01
  Top 0.4: 70.9,84.01 71.4,84.51 83.2,84.51 83.87,85.18 H7.2
095_17
  Top 0.3: IC4.17 70.4,84.71
  Top 0.4: 70.4,84.71 71.1,85.41 80.1,85.41 81.33,86.64 H7.3
095_18
  Top 0.3: IC4.18 69.9,85.41
  Top 0.4: 69.9,85.41 70.7,86.21 77.7,86.21 78.79,87.3 H7.4
095_19
  Top 0.3: IC4.19 69.4,86.11
  Top 0.4: 69.4,86.11 70.3,87.01 75.6,87.01 76.25,87.66 H7.5
095_20
  Top 0.3: IC4.20 68.9,86.81
  Top 0.4: 68.9,86.81 69.9,87.81 73.1,87.81 73.71,88.42 H7.6
095_21
  Top 0.3: IC4.21 68.4,87.51
  Top 0.4: 68.4,87.51 69.5,88.61 70.8,88.61 71.17,88.98 H7.7
095_22
  Top 0.3: IC4.22 67.4,88.53 H7.8
095_23
  Top 0.3: IC4.23 66.3,80.6 66,80.9
  Top 0.4: 66,80.9 66,89.67 H7.9
095_24
  Top 0.3: IC4.24 65.7,80.1 63.55,82.25 H7.10
095_25
  Top 0.3: IC4.25 65.3,79.6 61.01,83.89 H7.11
095_26
  Top 0.3: IC4.26 64.9,79.1 58.47,85.53 H7.12
095_27
  Top 0.3: IC4.27 64.5,78.6 55.93,87.17 H7.13
095_28
  Top 0.3: IC4.28 64.1,78.1 53.39,88.81 H7.14
095_GND  (via drill 0.3)
  other vias: 69.9,79.6 69.9,78.33 68.63,78.33 68.63,79.6 68.63,80.87 69.9,80.87 71.17,80.87 71.17,79.6 71.17,78.33 52.84,76.49 52.84,81.57 52.84,86.65 56.65,79.03 56.65,83.11 60.46,77.76 65.1,76.9 54.6,71.14 57.14,71.14 59.68,71.14 62.22,71.14 64.76,71.14 64.76,85.83 85.19,88.15 82.65,88.15 80.01,88.15 77.53,88.13 74.89,88.23 87.13,72.68 87.13,77.76 87.13,83.2 83.32,76.22 83.32,81.3 79.51,79.33 75.3,82.2
  pour Bottom (isolate 0.1): 51.4,67.6 88.4,67.6 88.4,91.6 51.4,91.6
  pour Top (isolate 0.1): 51.4,67.6 51.4,91.6 88.4,91.6 88.4,67.6
096_GND  (via drill 0.3)
  other vias: 70.4,23.2 70.4,21.93 70.4,24.47 69.13,23.2 69.13,21.93 69.13,24.47 71.67,24.47 71.67,23.2 71.67,21.93 55.26,13.2 55.36,15.54 55.36,18.23 55.36,20.67 55.36,23.26 55.36,25.65 55.36,28.29 55.36,30.83 55.36,33.37 85.54,13.05 85.54,15.59 85.54,18.13 85.54,20.77 85.54,23.16 85.54,25.75 85.54,28.29 85.54,30.83 85.54,33.47 66.5,19.5 74.6,26.9 74.6,19.48 66.5,26.98 60.25,10.55 62.79,10.55 65.33,10.55 67.87,10.55 70.41,10.55 72.95,10.55 75.49,10.55 78.03,10.55 80.57,10.55 60.25,35.95 62.79,35.95 65.33,35.95 67.87,35.95 70.41,35.95 72.95,35.95 75.49,35.95 78.03,35.95 80.57,35.95
  pour Bottom (isolate 0.1): 51.4,7.2 89.4,7.2 89.4,39.2 51.4,39.2
  pour Top (isolate 0.1): 51.4,7.2 51.4,39.2 89.4,39.2 89.4,7.2
097_GND  (via drill 0.3)
  other vias: 104.1,75.57 104.1,76.84 105.37,76.84 105.37,75.57 105.37,74.3 104.1,74.3 102.83,74.3 102.83,75.57 102.83,76.84 99.02,88.27 96.48,88.27 101.56,88.27 104.1,88.27 106.64,88.27 109.18,88.27 111.72,88.27 93.94,83.19 93.94,80.65 93.94,78.11 93.94,75.57 93.94,73.03 93.94,70.49 93.94,67.95 96.48,62.87 99.02,62.87 101.56,62.87 104.1,62.87 106.64,62.87 109.18,62.87 111.72,62.87 114.26,67.95 114.26,70.49 114.26,73.03 114.26,75.57 114.26,78.11 114.26,80.65 114.26,83.19 107.28,79.38 100.92,79.38 100.92,71.76 107.28,71.76
  pour Bottom (isolate 0.1): 117.6,91.6 90.6,91.6 90.6,59.6 117.6,59.6
  pour Top (isolate 0.1): 90.6,91.6 117.6,91.6 117.6,59.6 90.6,59.6
098_1
  Top 0.3: IC1.1 129.75,70.35 129.4,70.7 129.4,81.91 H1.1
098_2
  Top 0.3: IC1.2 129.35,69.85 128.8,70.4 128.8,81.6 123.25,87.15 H1.2
098_3
  Top 0.3: IC1.3 128.95,69.35 128.2,70.1 128.2,81.3 124.89,84.61 H1.3
098_4
  Top 0.3: IC1.4 128.55,68.85 127.6,69.8 127.6,81 126.53,82.07 H1.4
098_5
  Top 0.3: IC1.5 128.15,68.35 127,69.5 127,78.1 125.57,79.53 H1.5
098_6
  Top 0.3: IC1.6 127.75,67.85 126.4,69.2 126.4,75.2 124.61,76.99 H1.6
098_7
  Top 0.3: IC1.7 127.35,67.35 125.8,68.9 125.8,72.4 123.75,74.45 H1.7
098_8
  Top 0.3: IC1.8 126.95,66.85 125.2,68.6 125.2,70.4 123.69,71.91 H1.8
098_9
  Top 0.3: IC1.9 126.55,66.35 123.53,69.37 H1.9
098_10
  Top 0.3: IC1.10 126.15,65.85 125.17,66.83 H1.10
098_11
  Top 0.3: IC1.11 131.3,64.5 131.09,64.29 H1.11
098_12
  Top 0.3: IC1.12 131.8,63.9 131.35,63.45
  Top 0.4: 131.35,63.45 123.32,63.45 H1.12
098_13
  Top 0.3: IC1.13 132.3,63.1 131.8,62.6
  Top 0.4: 131.8,62.6 125.01,62.6 H1.13
098_14
  Top 0.3: IC1.14 132.8,62.3 132.3,61.8
  Top 0.4: 132.3,61.8 126.75,61.8 H1.14
098_15
  Top 0.3: IC1.15 133.3,61.5 132.8,61
  Top 0.4: 132.8,61 128.49,61 H1.15
098_16
  Top 0.3: IC1.16 133.8,60.8 133.2,60.2
  Top 0.4: 133.2,60.2 130.23,60.2 H1.16
098_17
  Top 0.3: IC1.17 134.3,60.2 133.4,59.3 131.87,59.3 H1.17
098_18
  Top 0.3: IC1.18 134.8,59.69 H1.18
098_19
  Top 0.3: IC1.19 136.35,65.85 136.7,65.5 136.7,54.29 H3.1
098_20
  Top 0.3: IC1.20 136.75,66.35 137.3,65.8 137.3,54.6 142.85,49.05 H3.2
098_21
  Top 0.3: IC1.21 137.15,66.85 137.9,66.1 137.9,54.9 141.21,51.59 H3.3
098_22
  Top 0.3: IC1.22 137.55,67.35 138.5,66.4 138.5,55.2 139.57,54.13 H3.4
098_23
  Top 0.3: IC1.23 137.95,67.85 139.1,66.7 139.1,58.7 141.13,56.67 H3.5
098_24
  Top 0.3: IC1.24 138.55,68.35 138.7,68.2
  Top 0.4: 138.7,68.2 139.9,67 139.9,61.1 141.79,59.21 H3.6
098_25
  Top 0.3: IC1.25 139.15,68.85 140.7,67.3 140.7,64 142.95,61.75 H3.7
098_26
  Top 0.3: IC1.26 139.55,69.35 141.3,67.6 141.3,65.6 142.61,64.29 H3.8
098_27
  Top 0.3: IC1.27 139.95,69.85 142.97,66.83 H3.9
098_28
  Top 0.3: IC1.28 143.5,70.35 H3.10
098_29
  Top 0.3: IC1.29 134.8,71.7 135,71.9
  Top 0.4: 135,71.9 H3.11
098_30
  Top 0.3: IC1.30 134.3,72.4 134.6,72.7
  Top 0.4: 134.6,72.7 142.73,72.7 H3.12
098_31
  Top 0.3: IC1.31 133.8,73.2 134.1,73.5
  Top 0.4: 134.1,73.5 140.99,73.5 H3.13
098_32
  Top 0.3: IC1.32 133.3,74 133.6,74.3
  Top 0.4: 133.6,74.3 139.25,74.3 H3.14
098_33
  Top 0.3: IC1.33 132.8,74.9 133,75.1
  Top 0.4: 133,75.1 137.51,75.1 H3.15
098_34
  Top 0.3: IC1.34 132.3,75.6 132.6,75.9
  Top 0.4: 132.6,75.9 135.77,75.9 H3.16
098_35
  Top 0.3: IC1.35 131.8,76.3 132.2,76.7
  Top 0.4: 132.2,76.7 134.03,76.7 H3.17
098_36
  Top 0.3: IC1.36 131.3,76.9 144.09,89.69 H3.18
098_GND  (via drill 0.3)
  other vias: 124.88,90.32 129.96,90.32 135.04,90.32 140.12,90.32 132.5,85.24 131.23,78.89 124.88,45.87 129.96,45.87 135.04,45.87 140.12,45.87 132.5,50.95 135.04,57.3 122.98,85.82 122.98,83.28 122.98,80.74 122.98,78.2 122.98,75.66 122.98,73.12 122.98,70.58 122.98,68.04 122.98,65.5 123.47,52.07 123.47,49.63 143.32,50.33 143.32,52.87 143.32,55.41 143.32,57.95 143.32,60.49 143.32,63.03 143.32,65.57 143.32,68.11 142.19,86.44 133.05,68.1 133.05,69.37 134.32,69.37 133.05,66.83 131.78,66.83 131.78,69.37 134.32,66.83 131.78,68.1 134.32,68.1
  pour Bottom (isolate 0.1): 119.8,91.6 119.8,44.6 146.3,44.6 146.3,91.6
  pour Top (isolate 0.1): 119.8,91.6 146.3,91.6 146.3,44.6 119.8,44.6
100_1
  Top 0.3: IC11.1 107.85,18.05 107.6,17.8 105.2,17.8 H25.1
100_2
  Top 0.3: IC11.2 108.35,17.65 107.9,17.2 105.5,17.2 99.17,10.87 H25.2
100_3
  Top 0.3: H25.3 101.71,11.61 106.7,16.6 108.2,16.6 108.85,17.25 IC11.3
100_4
  Top 0.3: H25.4 104.25,13.25 107,16 108.5,16 109.35,16.85 IC11.4
100_5
  Top 0.3: H25.5 106.79,14.79 107.4,15.4 108.8,15.4 109.85,16.45 IC11.5
100_6
  Top 0.3: H25.6 109.33,14.93 110.35,15.95 IC11.6
100_7
  Top 0.3: H25.7 111.87,14.43 110.85,15.45 IC11.7
100_8
  Top 0.3: H25.8 114.41,14.29 113.9,14.8 112.5,14.8 111.35,15.95 IC11.8
100_9
  Top 0.3: H25.9 116.95,12.95 114.4,15.5 112.7,15.5 111.85,16.35 IC11.9
100_10
  Top 0.3: H25.10 119.49,11.41 114.8,16.1 113,16.1 112.35,16.75 IC11.10
100_11
  Top 0.3: IC11.11 112.85,17.55 113.6,16.8 116.1,16.8 122.03,10.87 H25.11
100_12
  Top 0.3: IC11.12 113.35,17.95 113.8,17.5 116.3,17.5 H25.12
100_13
  Top 0.3: IC11.13 115.85,20.45 116.1,20.2
  Top 0.4: 116.1,20.2 127.07,9.23 H26.1
100_14
  Top 0.3: IC11.14 116.45,20.95 125.63,11.77 H26.2
100_15
  Top 0.3: IC11.15 117.05,21.45 117.2,21.3
  Top 0.4: 117.2,21.3 124.19,14.31 H26.3
100_16
  Top 0.3: IC11.16 117.75,21.95 122.85,16.85 H26.4
100_17
  Top 0.3: IC11.17 118.35,22.45 118.5,22.3
  Top 0.4: 118.5,22.3 121.41,19.39 H26.5
100_18
  Top 0.3: IC11.18 119.05,22.95 120.07,21.93 H26.6
100_19
  Top 0.3: IC11.19 119.35,23.45 119.5,23.6
  Top 0.4: 119.5,23.6 120.37,24.47 H26.7
100_20
  Top 0.3: IC11.20 118.75,23.95 121.81,27.01 H26.8
100_21
  Top 0.3: IC11.21 118.15,24.45 118.3,24.6
  Top 0.4: 118.3,24.6 123.25,29.55 H26.9
100_22
  Top 0.3: IC11.22 117.45,24.95 124.59,32.09 H26.10
100_23
  Top 0.3: IC11.23 117.05,25.45 126.23,34.63 H26.11
100_24
  Top 0.3: IC11.24 115.89,25.95 H26.12
100_25
  Top 0.3: IC11.25 113.35,28.65 113.7,29 116.4,29 H27.1
100_26
  Top 0.3: IC11.26 112.85,29.05 113.5,29.7 116.1,29.7 122.03,35.63 H27.2
100_27
  Top 0.3: IC11.27 112.35,29.75 113,30.4 115.4,30.4 119.49,34.49 H27.3 119.49,36.89
100_28
  Top 0.3: IC11.28 111.85,30.15 116.95,35.25 H27.4
100_29
  Top 0.3: IC11.29 111.35,30.55 114.41,33.61 H27.5
100_30
  Top 0.3: IC11.30 110.85,30.95 111.87,31.97 H27.6
100_31
  Top 0.3: IC11.31 110.35,30.95 109.33,31.97 H27.7
100_32
  Top 0.3: IC11.32 109.85,30.35 109.6,30.6
  Top 0.4: 109.6,30.6 106.79,33.41 H27.8
100_33
  Top 0.3: IC11.33 109.35,29.75 108.5,30.6 105.9,30.6 104.25,32.25 H27.9
100_34
  Top 0.3: IC11.34 108.85,29.35 108.2,30 105.6,30 101.71,33.89 H27.10
100_35
  Top 0.3: IC11.35 108.35,28.95 107.9,29.4 105.3,29.4 99.17,35.53 H27.11
100_36
  Top 0.3: IC11.36 107.85,28.55 107.6,28.8 105,28.8 H27.12
100_37
  Top 0.3: IC11.37 105.55,25.95 94.33,37.17 H28.1
100_38
  Top 0.3: IC11.38 104.95,25.45 104.8,25.6
  Top 0.4: 104.8,25.6 95.77,34.63 H28.2
100_39
  Top 0.3: 104,25.2 104.25,24.95 IC11.39
  Top 0.4: 104,25.2 97.11,32.09 H28.3
100_40
  Top 0.3: IC11.40 103.45,24.45 103.2,24.7
  Top 0.4: 103.2,24.7 98.35,29.55 H28.4
100_41
  Top 0.3: IC11.41 102.75,23.95 99.69,27.01 H28.5
100_42
  Top 0.3: IC11.42 102.15,23.45 102,23.6
  Top 0.4: 102,23.6 101.13,24.47 H28.6
100_43
  Top 0.3: H28.7 101.33,21.93 102.35,22.95 IC11.43
100_44
  Top 0.3: IC11.44 102.95,22.45 102.8,22.3
  Top 0.4: 102.8,22.3 99.89,19.39 H28.8
100_45
  Top 0.3: IC11.45 103.55,21.95 98.4,16.8 94.14,16.8 H28.9
100_46
  Top 0.3: 103.8,21.1 104.15,21.45 IC11.46
  Top 0.4: 103.8,21.1 97.01,14.31 H28.10
100_47
  Top 0.3: IC11.47 104.75,20.95 95.57,11.77 H28.11
100_48
  Top 0.3: 104.9,20 105.35,20.45 IC11.48
  Top 0.4: 104.9,20 94.13,9.23 H28.12
100_GND  (via drill 0.3)
  other vias: 110.6,21.93 110.6,24.47 109.33,23.2 109.33,21.93 109.33,24.47 111.87,24.47 111.87,23.2 111.87,21.93 95.46,13.2 95.56,15.54 95.56,18.23 95.56,20.67 95.56,23.26 95.56,25.65 95.56,28.29 95.56,30.83 95.56,33.37 125.74,13.05 125.74,15.59 125.74,18.13 125.74,20.77 125.74,23.16 125.74,25.75 125.74,28.29 125.74,30.83 106.7,19.5 114.8,26.9 114.8,19.48 106.7,26.98 100.45,10.55 102.99,10.55 105.53,10.55 108.07,10.55 110.61,10.55 113.15,10.55 115.69,10.55 118.23,10.55 120.77,10.55 105.53,35.95 108.07,35.95 110.61,35.95 113.15,35.95 115.69,35.95 118.23,35.95 120.77,35.95 102.93,35.95
  pour Bottom (isolate 0.1): 91.6,7.2 129.6,7.2 129.6,39.2 91.6,39.2
  pour Top (isolate 0.1): 91.6,7.2 91.6,39.2 129.6,39.2 129.6,7.2
FRAME
  pour Top (hatched): 0.3,99.7 4.6,99.7 4.6,0.3 0.3,0.3
  pour Top (hatched): 4.6,99.7 159.7,99.7 159.7,94.2 4.6,94.2
  pour Top (hatched): 150.4,95.4 159.7,95.4 159.7,0.3 150.4,0.3
  pour Top (hatched): 4.6,0.3 4.6,4.6 152.4,4.6 152.4,0.3
  pour Top (hatched): 132.2,17.8 152.4,17.8 152.4,4.6 132.2,4.6
FRAME1
  pour Bottom (hatched): 0.3,99.7 4.6,99.7 4.6,0.3 0.3,0.3
  pour Bottom (hatched): 4.6,99.7 159.7,99.7 159.7,94.2 4.6,94.2
  pour Bottom (hatched): 150.4,95.4 159.7,95.4 159.7,0.3 150.4,0.3
  pour Bottom (hatched): 4.6,0.3 4.6,4.6 152.4,4.6 152.4,0.3
  pour Bottom (hatched): 132.2,17.8 152.4,17.8 152.4,4.6 132.2,4.6
N$1
  cutout Top: 144.45,38 145.05,38.6 145.25,38.4 145.25,37.5 144.75,37 144.55,37 144.45,37.1
N$2
  cutout Top: 144.65,32.4 144.85,32.6 145.05,32.6 145.15,32.5 145.15,32.2 144.75,32.2 144.65,32.3
N$3
  cutout Top: 144.75,30.3 145.05,29.8 145.25,29.8 145.25,30.4 145.05,30.6 144.25,30.7 144.25,30.6
N$4
  cutout Top: 144.65,25.7 144.65,24.7 145.25,24.1 145.25,25.3 144.75,25.8
N$5
  cutout Top: 134.55,25.5 134.55,24.8 134.35,24.6 134.35,24.4 134.45,24.3 134.55,24.3 134.95,24.7 135.25,25.9 135.15,26 134.85,25.9
N$6
  cutout Top: 134.35,29.5 134.55,30.6 135.35,30.7 134.75,29.9 134.35,29.4
N$7
  cutout Top: 134.45,32.4 134.65,32.6 134.95,32.3 134.95,32.1 134.55,32.2
N$8
  cutout Top: 134.35,38.4 134.55,38 134.55,37.5 134.45,37.4 135.05,36.8 135.15,36.9 135.15,37.9 134.55,38.5 134.35,38.5
N$9
  cutout Top: 25.6,19.95 25.6,20.95 25.9,20.95 25.9,20.25 25.8,20.25 25.8,19.95
N$10
  cutout Top: 27.8,17.75 27.8,18.15 28.7,18.15 28.7,17.75
N$11
  cutout Top: 27.8,22.75 27.8,23.15 28.6,23.15 28.6,22.75
N$12
  cutout Top: 30.6,20.05 30.6,20.85 31,20.85 31,20.05
N$13
  Top 0.3: IC9.P$1 67.65,18.75 67.4,18.5 65.7,18.5 H20.1
N$14
  Top 0.3: IC9.P$2 68.15,18.35 67.7,17.9 66.2,17.9 58.97,10.67 H20.2
N$15
  Top 0.3: IC9.P$3 68.65,17.95 68,17.3 66.5,17.3 61.51,12.31 H20.3
N$16
  Top 0.3: IC9.P$4 69.15,17.55 68.3,16.7 66.8,16.7 64.05,13.95 H20.4
N$17
  Top 0.3: IC9.P$5 69.65,17.15 68.6,16.1 67.2,16.1 66.59,15.49 H20.5
N$18
  Top 0.3: IC9.P$6 70.15,16.65 69.13,15.63 H20.6
N$19
  Top 0.3: IC9.P$7 70.65,16.65 71.67,15.63 H20.7
N$20
  Top 0.3: IC9.P$8 71.15,17.15 72.3,16 73.7,16 74.21,15.49 H20.8
N$21
  Top 0.3: IC9.P$9 71.65,17.55 72.5,16.7 74.2,16.7 76.75,14.15 H20.9
N$22
  Top 0.3: IC9.P$10 72.15,17.95 72.8,17.3 74.5,17.3 79.29,12.51 H20.10
N$23
  Top 0.3: IC9.P$11 72.65,18.35 73.1,17.9 74.8,17.9 81.83,10.87 H20.11
N$24
  Top 0.3: IC9.P$12 73.15,18.75 73.4,18.5 75.1,18.5 H20.12
N$25
  Top 0.3: IC9.P$13 75.05,20.45 86.27,9.23 H21.1
N$26
  Top 0.3: IC9.P$14 75.65,20.95 75.9,20.7
  Top 0.4: 75.9,20.7 84.83,11.77 H21.2
N$27
  Top 0.3: IC9.P$15 76.35,21.45 76.6,21.2
  Top 0.4: 76.6,21.2 83.49,14.31 H21.3
N$28
  Top 0.3: IC9.P$16 77,21.95 77.3,21.65
  Top 0.4: 77.3,21.65 82.1,16.85 H21.4
N$29
  Top 0.3: IC9.P$17 77.65,22.45 77.9,22.2
  Top 0.4: 77.9,22.2 80.71,19.39 H21.5
N$30
  Top 0.3: IC9.P$18 78.25,22.95 79.27,21.93 H21.6
N$31
  Top 0.3: IC9.P$19 78.35,23.45 78.6,23.7
  Top 0.4: 78.6,23.7 79.37,24.47 H21.7
N$32
  Top 0.3: IC9.P$20 77.65,23.95 77.9,24.2
  Top 0.4: 77.9,24.2 80.71,27.01 H21.8
N$33
  Top 0.3: IC9.P$21 76.95,24.45 77.2,24.7
  Top 0.4: 77.2,24.7 82.05,29.55 H21.9
N$34
  Top 0.3: IC9.P$22 76.25,24.95 76.5,25.2
  Top 0.4: 76.5,25.2 83.39,32.09 H21.10
N$35
  Top 0.3: IC9.P$23 75.65,25.45 84.83,34.63 H21.11
N$36
  Top 0.3: IC9.P$24 75.3,25.95 84.95,35.6 85.34,35.6 H21.12
N$37
  Top 0.3: IC9.P$25 73.15,27.55 73.4,27.8 75,27.8 H23.1
N$38
  Top 0.3: IC9.P$26 72.65,27.95 73.1,28.4 74.7,28.4 81.83,35.53 H23.2
N$39
  Top 0.3: IC9.P$27 72.15,28.35 72.8,29 74.4,29 79.29,33.89 H23.3
N$40
  Top 0.3: IC9.P$28 71.65,28.75 72.5,29.6 74.1,29.6 76.75,32.25 H23.4
N$41
  Top 0.3: IC9.P$29 71.15,29.15 72.2,30.2 73.8,30.2 74.21,30.61 H23.5
N$42
  Top 0.3: IC9.P$30 70.65,30.15 70.95,30.45
  Top 0.4: 70.95,30.45 71.67,31.17 H23.6
N$43
  Top 0.3: IC9.P$31 70.15,30.2 69.9,30.45
  Top 0.4: 69.9,30.45 69.13,31.22 H23.7
N$44
  Top 0.3: IC9.P$32 69.65,29.6 68.6,30.65 67.05,30.65 66.59,31.11 H23.8
N$45
  Top 0.3: IC9.P$33 69.15,29.2 68.3,30.05 66.65,30.05 64.05,32.65 H23.9
N$46
  Top 0.3: IC9.P$34 68.65,28.65 68,29.3 67.7,29.3
  Top 0.4: 67.7,29.3 66.3,29.3 61.51,34.09 H23.10
N$47
  Top 0.3: IC9.P$35 68.15,28.05 67.7,28.5 66,28.5 58.97,35.53 H23.11
N$48
  Top 0.3: IC9.P$36 67.65,27.65 67.4,27.9 65.7,27.9 H23.12
N$49
  Top 0.3: IC9.P$37 65.25,25.95 65,26.2
  Top 0.4: 65,26.2 54.03,37.17 H22.1
N$50
  Top 0.3: IC9.P$38 64.65,25.45 55.47,34.63 H22.2
N$51
  Top 0.3: IC9.P$39 64.05,24.95 63.8,25.2
  Top 0.4: 63.8,25.2 56.91,32.09 H22.3
N$52
  Top 0.3: IC9.P$40 63.35,24.45 63.1,24.7
  Top 0.4: 63.1,24.7 58.25,29.55 H22.4
N$53
  Top 0.3: IC9.P$41 62.65,23.95 62.4,24.2
  Top 0.4: 62.4,24.2 59.59,27.01 H22.5
N$54
  Top 0.3: IC9.P$42 61.95,23.45 60.93,24.47 H22.6
N$55
  Top 0.3: IC9.P$43 61.95,22.95 60.93,21.93 H22.7
N$56
  Top 0.3: IC9.P$44 62.45,22.45 59.39,19.39 H22.8
N$57
  Top 0.3: IC9.P$45 63.15,21.95 62.9,21.7
  Top 0.4: 62.9,21.7 58.05,16.85 H22.9
N$58
  Top 0.3: IC9.P$46 63.85,21.45 63.5,21.1
  Top 0.4: 63.5,21.1 56.71,14.31 H22.10
N$59
  Top 0.3: IC9.P$47 64.55,20.95 64.3,20.7
  Top 0.4: 64.3,20.7 55.37,11.77 H22.11
N$60
  Top 0.3: IC9.P$48 65.15,20.45 53.93,9.23 H22.12
N$61
  Top 0.3: IC5.1 100.35,77.82 99.97,78.2 99.97,79.7 H9.1
N$62
  Top 0.3: IC5.2 99.95,77.32 99.37,77.9 99.37,79.4 94.31,84.46 H9.2
N$63
  Top 0.3: IC5.3 99.55,76.82 98.77,77.6 98.77,79.1 95.95,81.92 H9.3
N$64
  Top 0.3: IC5.4 99.15,76.32 98.17,77.3 98.17,78.8 97.59,79.38 H9.4
N$65
  Top 0.3: IC5.5 98.75,75.82 97.73,76.84 H9.5
N$66
  Top 0.3: IC5.6 98.69,75.32 97.67,74.3 H9.6
N$67
  Top 0.3: IC5.7 99.09,74.82 98.17,73.9 98.17,72.3 97.63,71.76 H9.7
N$68
  Top 0.3: IC5.8 99.49,74.32 98.77,73.6 98.77,72 95.99,69.22 H9.8
N$69
  Top 0.3: IC5.9 99.89,73.82 99.37,73.3 99.37,71.7 94.35,66.68 H9.9
N$70
  Top 0.3: IC5.10 100.29,73.32 99.97,73 99.97,71.44 H9.10
N$71
  Top 0.3: IC5.11 101.85,70.78 H11.1
N$72
  Top 0.3: IC5.12 102.35,70.38 95.21,63.24 H11.2
N$73
  Top 0.3: IC5.13 102.85,69.98 97.75,64.88 H11.3
N$74
  Top 0.3: IC5.14 103.35,69.58 100.29,66.52 H11.4
N$75
  Top 0.3: IC5.15 103.85,69.18 102.83,68.16 H11.5
N$76
  Top 0.3: IC5.16 104.35,69.22 105.37,68.2 H11.6
N$77
  Top 0.3: IC5.17 104.85,69.62 107.91,66.56 H11.7
N$78
  Top 0.3: IC5.18 105.35,70.02 110.45,64.92 H11.8
N$79
  Top 0.3: IC5.19 105.85,70.42 112.99,63.28 H11.9
N$80
  Top 0.3: IC5.20 106.35,70.78 H11.10
N$81
  Top 0.3: IC5.21 107.95,73.32 108.27,73 108.27,71.4 H13.1
N$82
  Top 0.3: IC5.22 108.35,73.82 108.87,73.3 108.87,71.7 113.89,66.68 H13.2
N$83
  Top 0.3: IC5.23 108.75,74.32 109.47,73.6 109.47,72 112.25,69.22 H13.3
N$84
  Top 0.3: IC5.24 109.15,74.82 110.07,73.9 110.07,72.3 110.61,71.76 H13.4
N$85
  Top 0.3: IC5.25 109.55,75.32 110.57,74.3 H13.5
N$86
  Top 0.3: IC5.26 109.59,75.82 110.61,76.84 H13.6
N$87
  Top 0.3: IC5.27 109.19,76.32 110.07,77.2 110.07,78.9 110.55,79.38 H13.7
N$88
  Top 0.3: IC5.28 108.79,76.82 109.47,77.5 109.47,79.2 112.19,81.92 H13.8
N$89
  Top 0.3: IC5.29 108.39,77.32 108.87,77.8 108.87,79.5 113.83,84.46 H13.9
N$90
  Top 0.3: IC5.30 107.99,77.82 108.27,78.1 108.27,79.79 115.48,87 H13.10
N$91
  Top 0.3: IC5.31 106.35,80.36 H12.1
N$92
  Top 0.3: IC5.32 105.85,80.78 112.99,87.92 H12.2
N$93
  Top 0.3: IC5.33 105.35,81.18 110.45,86.28 H12.3
N$94
  Top 0.3: IC5.34 104.85,81.58 107.91,84.64 H12.4
N$95
  Top 0.3: IC5.35 104.35,81.98 105.37,83 H12.5
N$96
  Top 0.3: IC5.36 103.85,81.97 102.83,82.99 H12.6
N$97
  cutout Top: 2,98 5,98 5,95 2,95
N$98
  Top 0.3: IC5.37 103.35,81.52 100.29,84.58 H12.7
N$99
  Top 0.3: IC5.38 102.85,81.12 97.75,86.22 H12.8
N$100
  Top 0.3: IC5.39 102.35,80.72 95.21,87.86 H12.9
N$101
  Top 0.3: IC5.40 101.85,80.36 H12.10
N$102
  cutout Top: 155,98 158,98 158,95 155,95
N$103
  cutout Top: 155,5 158,5 158,2 155,2
N$194
  cutout Top: 95,54.05 94.4,54.65 94.6,54.85 95.5,54.85 96,54.35 96,54.15 95.9,54.05
N$195
  cutout Top: 100.6,54.25 100.4,54.45 100.4,54.65 100.5,54.75 100.8,54.75 100.8,54.35 100.7,54.25
N$196
  cutout Top: 102.7,54.35 103.2,54.65 103.2,54.85 102.6,54.85 102.4,54.65 102.3,53.85 102.4,53.85
N$197
  cutout Top: 107.3,54.25 108.3,54.25 108.9,54.85 107.7,54.85 107.2,54.35
N$198
  cutout Top: 107.5,44.15 108.2,44.15 108.4,43.95 108.6,43.95 108.7,44.05 108.7,44.15 108.3,44.55 107.1,44.85 107,44.75 107.1,44.45
N$199
  cutout Top: 103.5,43.95 102.4,44.15 102.3,44.95 103.1,44.35 103.6,43.95
N$200
  cutout Top: 100.6,44.05 100.4,44.25 100.7,44.55 100.9,44.55 100.8,44.15
N$201
  cutout Top: 94.6,43.95 95,44.15 95.5,44.15 95.6,44.05 96.2,44.65 96.1,44.75 95.1,44.75 94.5,44.15 94.5,43.95
SO_1
  Top 0.4: IC3.1 61.65,47.23 61.2,46.79 55.26,46.79 53.49,45.02 H5.1
SO_2
  Top 0.4: IC3.2 62.91,47.2 61.6,45.89 57.36,45.89 56.03,44.56 H5.2
SO_3
  Top 0.4: IC3.3 64.19,47.17 61.74,44.73 60.07,44.73 H5.3
SO_4
  Top 0.3: IC3.4 65.45,46.88 61.8,43.23 H5.4
SO_5
  Top 0.3: IC3.5 66.72,47.22 63.65,44.14 H5.5
SO_6
  Top 0.3: IC3.6 68,46.12 66.19,44.32 H5.6
SO_7
  Top 0.3: IC3.7 69.27,43.77 H5.7
SO_8
  Top 0.3: IC3.8 70.53,43.97 H5.8
SO_9
  Top 0.3: IC3.9 71.81,45.23 H5.9
SO_10
  Top 0.3: IC3.10 73.08,46.51 H5.10
SO_11
  Top 0.3: IC3.11 74.34,46.45 76.16,44.63 77.49,44.63 H5.11
SO_12
  Top 0.4: IC3.12 75.61,46.42 76.51,45.53 79.13,45.53 H5.12
SO_13
  Top 0.4: IC3.13 76.89,47.2 77.3,46.79 80.41,46.79 H5.13
SO_14
  Top 0.4: H5.14 80.95,48.79 IC3.14
  Top 0.45: IC3.14
SO_15
  Top 0.4: H8.1 80.85,57.99 IC3.15
  Top 0.45: IC3.15
SO_16
  Top 0.4: IC3.16 76.89,59.58 77.65,60.34 80.66,60.34 H8.2
SO_17
  Top 0.3: IC3.17 75.61,59.51 77.66,61.55 79.33,61.55 H8.3
SO_18
  Top 0.3: IC3.18 74.34,60.09 76.41,62.15 77.39,62.15 H8.4
SO_19
  Top 0.4: IC3.19 73.08,60.38 H8.5
SO_20
  Top 0.3: IC3.20 71.81,61.65 H8.6
SO_21
  Top 0.3: IC3.21 70.53,62.91 H8.7
SO_22
  Top 0.3: IC3.22 69.27,62.91 H8.8
SO_23
  Top 0.3: IC3.23 68,61.65 H8.9
SO_24
  Top 0.3: IC3.24 66.72,60.38 H8.10
SO_25
  Top 0.3: IC3.25 65.45,59.44 61.34,63.55 H8.11
SO_26
  Top 0.3: IC3.26 64.19,59.6 61.96,61.83 60.19,61.83 H8.12
SO_27
  Top 0.4: IC3.27 62.91,59.67 61.6,60.99 57.06,60.99 55.93,62.12 H8.13
SO_28
  Top 0.4: IC3.28 61.65,59.65 61.2,60.09 55.46,60.09 53.39,62.16 H8.14
SO_GND  (via drill 0.3)
  other vias: 85.86,47.74 85.86,53.45 85.86,59.17 80.78,53.45 69.35,53.45 57.92,57.9 57.92,49.01 52.84,49.01 55.38,53.45 52.84,57.9
  pour Top (isolate 0.1): 51.4,41.4 51.4,65.4 88.4,65.4 88.4,41.4
  pour Bottom (isolate 0.1): 51.4,41.4 88.4,41.4 88.4,65.4 51.4,65.4
SSOP2_1
  Top 0.3: IC10.1 99.38,45.83 98.8,45.25 94.91,45.25 H19.1
SSOP2_2
  Top 0.3: IC10.2 100.01,45.46 99.2,44.65 96.85,44.65 H19.2
SSOP2_3
  Top 0.3: IC10.3 100.65,45.2 99.5,44.05 98.79,44.05 H19.3
SSOP2_4
  Top 0.3: IC10.4 101.28,44 H19.4
SSOP2_5
  Top 0.3: IC10.5 101.92,44 H19.5
SSOP2_6
  Top 0.3: IC10.6 102.55,45.4 103.9,44.05 104.41,44.05 H19.6
SSOP2_7
  Top 0.3: IC10.7 103.19,45.66 104.2,44.65 106.35,44.65 H19.7
SSOP2_8
  Top 0.3: IC10.8 103.82,45.88 104.45,45.25 108.29,45.25 H19.8
SSOP2_9
  Top 0.3: IC10.9 103.82,53.07 104.4,53.65 108.39,53.65 H24.1
SSOP2_10
  Top 0.3: IC10.10 103.19,53.29 104.2,54.3 106.5,54.3 H24.2
SSOP2_11
  Top 0.3: IC10.11 102.55,53.5 103.95,54.9 104.56,54.9 H24.3
SSOP2_12
  Top 0.3: IC10.12 101.92,54.8 H24.4
SSOP2_13
  Top 0.3: IC10.13 101.28,54.8 H24.5
SSOP2_14
  Top 0.3: IC10.14 100.65,53.6 99.4,54.85 98.69,54.85 H24.6
SSOP2_15
  Top 0.3: IC10.15 100.01,53.29 99.05,54.25 96.75,54.25 H24.7
SSOP2_16
  Top 0.3: IC10.16 99.38,53.07 98.8,53.65 94.81,53.65 H24.8
SSOP2_GND  (via drill 0.3)
  other vias: 96.09,46.75 96.09,51.83 106.25,46.75 106.25,51.83 111.33,46.75 108.79,49.29 111.33,51.83
  pour Top (isolate 0.1): 90.6,41.4 90.6,57.4 112.6,57.4 112.6,41.4
  pour Bottom (isolate 0.2): 90.6,41.4 112.6,41.4 112.6,57.4 90.6,57.4
SSOP_1
  Top 0.3: IC6.1 136.23,33.62 135.65,34.2 135.65,38.09 H10.1
SSOP_2
  Top 0.3: IC6.2 135.86,32.99 135.05,33.8 135.05,36.15 H10.2
SSOP_3
  Top 0.3: IC6.3 135.6,32.35 134.45,33.5 134.45,34.21 H10.3
SSOP_4
  Top 0.3: IC6.4 134.4,31.72 H10.4
SSOP_5
  Top 0.3: IC6.5 134.4,31.08 H10.5
SSOP_6
  Top 0.3: IC6.6 135.8,30.45 134.45,29.1 134.45,28.59 H10.6
SSOP_7
  Top 0.3: IC6.7 136.06,29.81 135.05,28.8 135.05,26.65 H10.7
SSOP_8
  Top 0.3: IC6.8 136.28,29.18 135.65,28.55 135.65,24.71 H10.8
SSOP_9
  Top 0.3: IC6.9 143.47,29.18 144.05,28.6 144.05,24.61 H14.1
SSOP_10
  Top 0.3: IC6.10 143.69,29.81 144.7,28.8 144.7,26.5 H14.2
SSOP_11
  Top 0.3: IC6.11 143.9,30.45 145.3,29.05 145.3,28.44 H14.3
SSOP_12
  Top 0.3: IC6.12 145.2,31.08 H14.4
SSOP_13
  Top 0.3: IC6.13 145.2,31.72 H14.5
SSOP_14
  Top 0.3: IC6.14 144,32.35 145.25,33.6 145.25,34.31 H14.6
SSOP_15
  Top 0.3: IC6.15 143.69,32.99 144.65,33.95 144.65,36.25 H14.7
SSOP_16
  Top 0.3: IC6.16 143.47,33.62 144.05,34.2 144.05,38.19 H14.8
SSOP_GND  (via drill 0.3)
  other vias: 142.23,26.75 142.23,21.67 137.15,21.67 139.69,24.21 137.15,26.75 137.15,36.91 142.23,36.91
  pour Bottom (isolate 0.2): 131.8,42.4 131.8,20.4 147.8,20.4 147.8,42.4
SSOP_GND1
  pour Top (isolate 0.1): 131.8,42.4 147.8,42.4 147.8,20.4 131.8,20.4

## Text on the board
tPlace: T-Bone BBQ | 40 | 39 | 38 | 37 | 36 | 35 | 34 | 33 | 32 | 31 | 32 | 1 | 32 | 31 | 30 | 29 | 28 | 27 | 26 | 25 | 24 | 23 | 22 | 21 | 20 | 19 | 18 | 17 | 28 | 27 | 26 | 25 | 24 | 23 | 22 | 21 | 20 | 19 | 18 | 17 | 16 | 15 | 1 | 30 | 2 | 31 | 29 | 30 | 2 | 3 | 28 | 4 | 29 | 3 | 27 | 28 | 4 | 5 | 26 | 6 | 27 | 5 | 25 | 26 | 6 | 7 | 24 | 8 | 25 | 1 | 2 | 3 | 4 | 5 | 6 | 7 | 8 | 9 | 10 | 11 | 12 | 13 | 14 | 7 | 23 | 24 | 8 | 9 | 1 | 2 | 3 | 4 | 5 | 6 | 7 | 8 | 9 | 10 | 11 | 12 | 13 | 14 | 15 | 16 | 22 | 10 | 23 | 9 | 21 | 22 | 10 | 11 | 28 | 27 | 26 | 25 | 24 | 23 | 22 | 21 | 20 | 19 | 18 | 17 | 16 | 15 | 21 | 12 | 11 | 12 | 13 | 14 | 15 | 16 | 17 | 18 | 19 | 20 | 20 | 32 | 31 | 30 | 29 | 28 | 27 | 26 | 25 | 24 | 23 | 22 | 21 | 20 | 19 | 18 | 17 | 13 | 19 | 14 | 18 | 16 | 15 | 14 | 13 | 12 | 11 | 10 | 9 | 15 | 17 | 16 | 1 | 2 | 3 | 4 | 5 | 6 | 7 | 8 | 9 | 10 | 11 | 12 | 13 | 14 | 1 | 2 | 3 | 4 | 5 | 6 | 7 | 8 | 16 | 1 | 1 | 2 | 3 | 4 | 5 | 6 | 7 | 8 | 9 | 10 | 11 | 12 | 13 | 14 | 15 | 16 | 37 | 37 | 15 | 24 | 24 | 2 | 14 | 38 | 36 | 35 | 34 | 33 | 32 | 31 | 30 | 29 | 28 | 27 | 26 | 25 | 38 | 36 | 35 | 34 | 33 | 32 | 31 | 30 | 29 | 28 | 27 | 26 | 25 | 3 | 23 | 23 | 39 | 39 | 13 | 4 | 32 | 31 | 30 | 29 | 28 | 27 | 26 | 25 | 24 | 23 | 22 | 21 | 20 | 19 | 18 | 17 | 22 | 22 | 12 | 40 | 40 | 5 | 21 | 21 | 41 | 41 | 11 | 6 | 20 | 20 | 10 | 42 | 42 | 7 | 19 | 19 | 43 | 43 | 9 | 8 | 18 | 18 | 44 | 44 | 17 | 17 | 45 | 45 | 16 | 16 | 46 | 46 | 15 | 15 | 47 | 47 | 1 | 2 | 3 | 4 | 5 | 6 | 7 | 8 | 9 | 10 | 11 | 12 | 13 | 14 | 15 | 16 | 1 | 2 | 3 | 4 | 5 | 6 | 7 | 8 | 9 | 10 | 11 | 12 | 14 | 1 | 2 | 3 | 4 | 5 | 6 | 7 | 8 | 9 | 10 | 11 | 12 | 14 | 48 | 48 | 13 | 13
bPlace: Trinamic IC: | TMC248-LI | Package: | QFN-28 5x5mm | Trinamic IC: | Package: | Trinamic IC: | TMC4330-LA | TMC4331-LA | QFN-32 4x4mm | TMC4361-LA | Trinamic IC: | Package: | QFN-40 6x6mm | TMC2130-LA | TMC2100-LA | TMC5130-LA | Package: | QFN-36 5x6mm | Trinamic IC: | Package: | TMC239A-SA | TMC249A-SA | SO-28 | Trinamic IC: | Package: | TMC262-LA | TMC389-LA | TMC429-LI | QFN-32 5x5mm | Trinamic IC: | TMC4210 | TMC429-I | Package: | SSOP-16 | Trinamic IC: | TMC4210 | TMC429-I | Trinamic IC: | TMC5031-LA | TMC5062-LA | TMC2031-LA | TMC5041-LA | Package: | QFN-48 7x7mm | Trinamic IC: | Package: | Package: | TMC5130-PA | TMC6131-PA | TQFP-48 7x7mm | SSOP-16 | Trinamic IC: | Package: | QFN-32 7x7mm | TMC222-LI | TMC223-LI | TMC249A-LA
_tsilk: VER.1.0 | REV.A